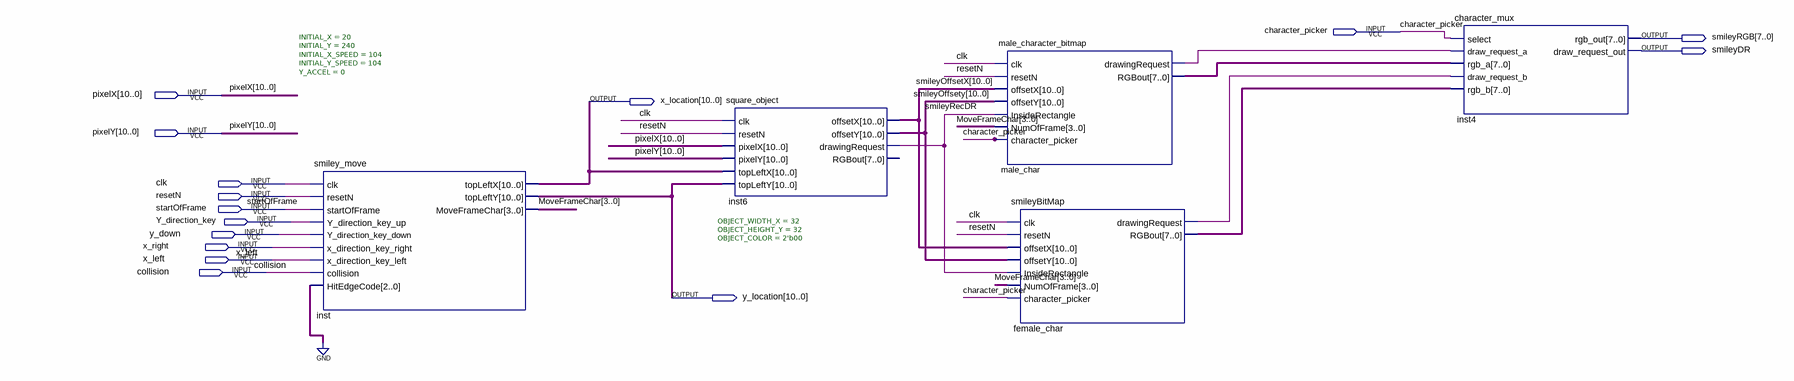
[diagram p0: schematic sheet]
// Quartus schematic Smiley_Block_T.bdf as structural Verilog: 5 symbols, 15 pins
module Smiley_Block_T (
  input  character_picker,
  input  [10:0] pixelX,
  input  [10:0] pixelY,
  input  clk,
  input  resetN,
  input  startOfFrame,
  input  Y_direction_key,
  input  y_down,
  input  x_right,
  input  x_left,
  input  collision,
  output [7:0] smileyRGB,
  output smileyDR,
  output [10:0] x_location,
  output [10:0] y_location
);

  wire female_char_drawingrequest, male_char_drawingrequest, smileyRecDR;
  wire [3:0] MoveFrameChar;
  wire [7:0] female_char_rgbout, male_char_rgbout;
  wire [10:0] smileyOffsetX, smileyOffsety;

  smiley_move #(.INITIAL_X(20), .INITIAL_Y(240), .INITIAL_X_SPEED(104), .INITIAL_Y_SPEED(104), .Y_ACCEL(0)) inst (
    .clk(clk), .resetN(resetN), .startOfFrame(startOfFrame), .Y_direction_key_up(Y_direction_key),
    .Y_direction_key_down(y_down), .x_direction_key_right(x_right), .x_direction_key_left(x_left),
    .collision(collision), .HitEdgeCode(3'b000), .topLeftX(x_location), .topLeftY(y_location),
    .MoveFrameChar(MoveFrameChar));
  square_object #(.OBJECT_WIDTH_X(32), .OBJECT_HEIGHT_Y(32), .OBJECT_COLOR(2'b00)) inst6 (
    .clk(clk), .resetN(resetN), .pixelX(pixelX), .pixelY(pixelY), .topLeftX(x_location),
    .topLeftY(y_location), .offsetX(smileyOffsetX), .offsetY(smileyOffsety), .drawingRequest(smileyRecDR));  // open: RGBout
  male_character_bitmap male_char (
    .clk(clk), .resetN(resetN), .offsetX(smileyOffsetX), .offsetY(smileyOffsety),
    .InsideRectangle(smileyRecDR), .NumOfFrame(MoveFrameChar), .character_picker(character_picker),
    .drawingRequest(male_char_drawingrequest), .RGBout(male_char_rgbout));
  smileyBitMap female_char (
    .clk(clk), .resetN(resetN), .offsetX(smileyOffsetX), .offsetY(smileyOffsety),
    .InsideRectangle(smileyRecDR), .NumOfFrame(MoveFrameChar), .character_picker(character_picker),
    .drawingRequest(female_char_drawingrequest), .RGBout(female_char_rgbout));
  character_mux inst4 (
    .select(character_picker), .draw_request_a(male_char_drawingrequest), .rgb_a(male_char_rgbout),
    .draw_request_b(female_char_drawingrequest), .rgb_b(female_char_rgbout), .rgb_out(smileyRGB),
    .draw_request_out(smileyDR));
endmodule
